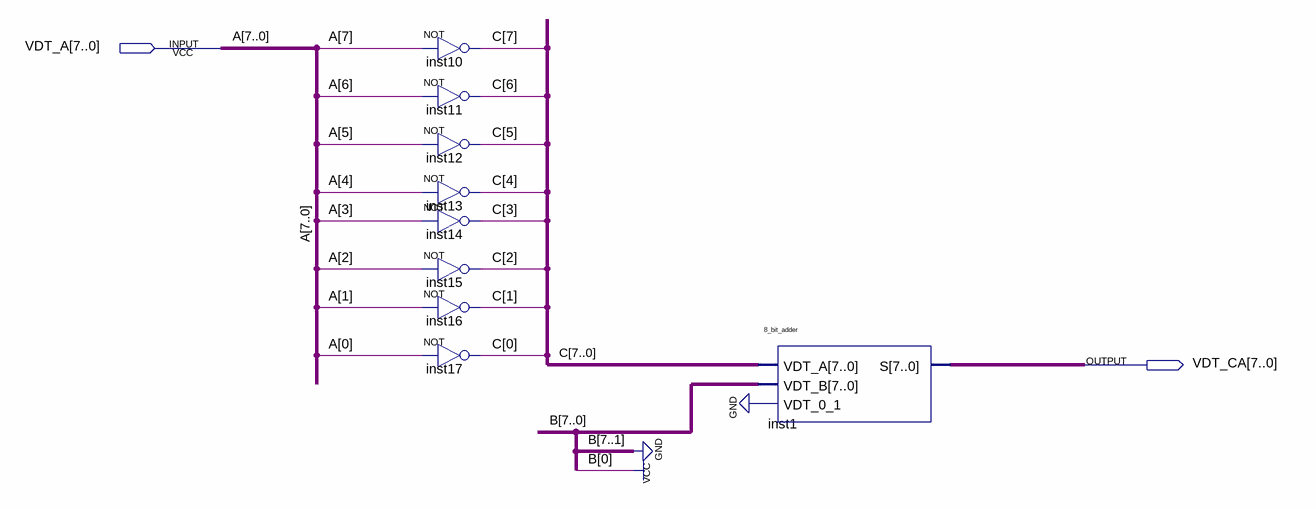
[diagram p0: schematic sheet]
// Quartus schematic COMP2.bdf as structural Verilog: 9 symbols, 2 pins
module COMP2 (
  input  [7:0] VDT_A,
  output [7:0] VDT_CA
);

  wire [7:0] C;

  not inst10 (C[7], VDT_A[7]);
  not inst11 (C[6], VDT_A[6]);
  not inst12 (C[5], VDT_A[5]);
  not inst13 (C[4], VDT_A[4]);
  not inst14 (C[3], VDT_A[3]);
  not inst15 (C[2], VDT_A[2]);
  not inst16 (C[1], VDT_A[1]);
  not inst17 (C[0], VDT_A[0]);
  \8_bit_adder  inst1 (.VDT_A(C), .VDT_B(8'b00000001), .VDT_0_1(1'b0), .S(VDT_CA));

  // Other names for the same wires on the sheet: A[7:0] = VDT_A
endmodule
